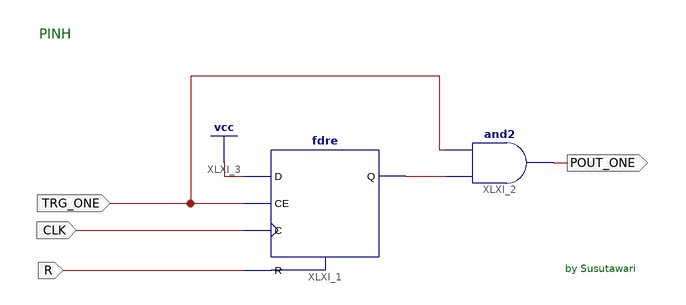
[diagram p0: schematic sheet 1]
// Xilinx ISE schematic PINH.sch (spartan3e) as structural Verilog: 2 symbols, 4 ports
module PINH (
  input  TRG_ONE,
  input  CLK,
  input  R,
  output POUT_ONE
);

  wire XLXN_1;

  fdre XLXI_1 (.C(CLK), .CE(TRG_ONE), .D(1'b1), .R(R), .Q(XLXN_1));
  and XLXI_2 (POUT_ONE, XLXN_1, TRG_ONE);

  // Notes on the sheet:
  //   PINH
  //   by Susutawari
endmodule
